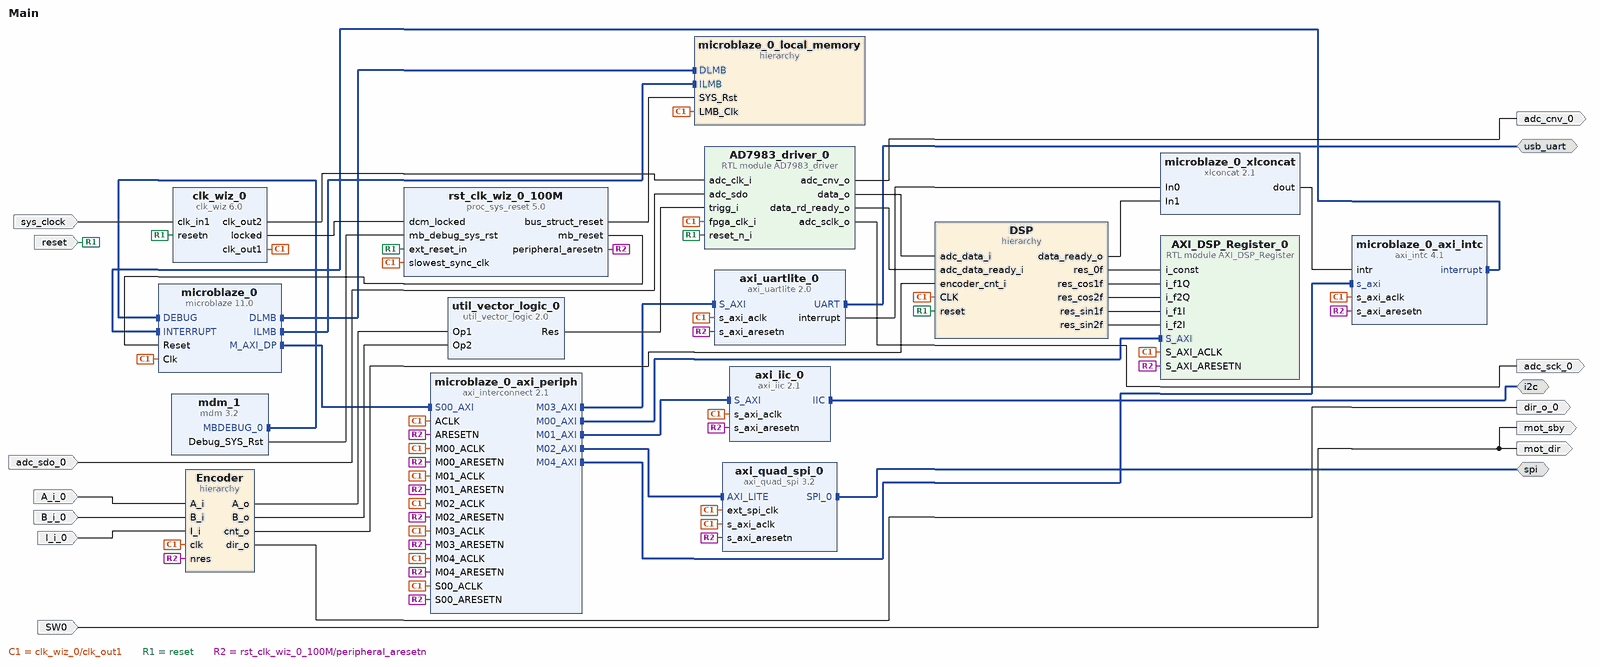
[diagram p0: block diagram of the top level]
# Vivado block design Main, xc7s25csga324-1, Vivado 2022.1
create_bd_design Main

create_bd_intf_port -mode Master -vlnv xilinx.com:interface:uart_rtl:1.0 usb_uart
create_bd_intf_port -mode Master -vlnv xilinx.com:interface:spi_rtl:1.0 spi
create_bd_intf_port -mode Master -vlnv xilinx.com:interface:iic_rtl:1.0 i2c
create_bd_port -dir I -type clk sys_clock
set_property -dict {CONFIG.FREQ_HZ 12000000 CONFIG.PHASE 0.0} [get_bd_ports sys_clock]
create_bd_port -dir I -type rst reset
set_property -dict {CONFIG.POLARITY ACTIVE_LOW} [get_bd_ports reset]
create_bd_port -dir I adc_sdo_0
create_bd_port -dir O adc_sck_0
create_bd_port -dir O adc_cnv_0
create_bd_port -dir I A_i_0
create_bd_port -dir I B_i_0
create_bd_port -dir I SW0
create_bd_port -dir O mot_dir
create_bd_port -dir O mot_sby
create_bd_port -dir I I_i_0
create_bd_port -dir O dir_o_0

create_bd_cell -type ip -vlnv xilinx.com:ip:microblaze:11.0 microblaze_0
set_property -dict [list \
  CONFIG.C_DEBUG_ENABLED 1 \
  CONFIG.C_D_AXI 1 \
  CONFIG.C_D_LMB 1 \
  CONFIG.C_I_LMB 1 \
  CONFIG.G_USE_EXCEPTIONS 1 \
] [get_bd_cells microblaze_0]
create_bd_cell -type ip -vlnv xilinx.com:ip:clk_wiz:6.0 clk_wiz_0
set_property -dict [list \
  CONFIG.CLKOUT1_JITTER 479.872 \
  CONFIG.CLKOUT1_PHASE_ERROR 668.310 \
  CONFIG.CLKOUT2_JITTER 560.330 \
  CONFIG.CLKOUT2_PHASE_ERROR 668.310 \
  CONFIG.CLKOUT2_REQUESTED_OUT_FREQ 30.000 \
  CONFIG.CLKOUT2_USED true \
  CONFIG.CLK_IN1_BOARD_INTERFACE sys_clock \
  CONFIG.MMCM_CLKFBOUT_MULT_F 62.500 \
  CONFIG.MMCM_CLKOUT0_DIVIDE_F 7.500 \
  CONFIG.MMCM_CLKOUT1_DIVIDE 25 \
  CONFIG.NUM_OUT_CLKS 2 \
  CONFIG.RESET_BOARD_INTERFACE reset \
  CONFIG.RESET_PORT resetn \
  CONFIG.RESET_TYPE ACTIVE_LOW \
  CONFIG.USE_BOARD_FLOW true \
] [get_bd_cells clk_wiz_0]
create_bd_cell -type hier microblaze_0_local_memory
create_bd_cell -type ip -vlnv xilinx.com:ip:axi_intc:4.1 microblaze_0_axi_intc
set_property -dict [list \
  CONFIG.C_EN_CASCADE_MODE 0 \
  CONFIG.C_HAS_FAST 0 \
  CONFIG.C_HAS_ILR 0 \
  CONFIG.C_IRQ_CONNECTION 0 \
  CONFIG.C_IRQ_IS_LEVEL 1 \
  CONFIG.C_NUM_SW_INTR 0 \
] [get_bd_cells microblaze_0_axi_intc]
create_bd_cell -type ip -vlnv xilinx.com:ip:xlconcat:2.1 microblaze_0_xlconcat
set_property -dict {CONFIG.NUM_PORTS 2} [get_bd_cells microblaze_0_xlconcat]
create_bd_cell -type ip -vlnv xilinx.com:ip:mdm:3.2 mdm_1
create_bd_cell -type ip -vlnv xilinx.com:ip:proc_sys_reset:5.0 rst_clk_wiz_0_100M
set_property -dict {CONFIG.RESET_BOARD_INTERFACE reset CONFIG.USE_BOARD_FLOW true} [get_bd_cells rst_clk_wiz_0_100M]
create_bd_cell -type ip -vlnv xilinx.com:ip:axi_uartlite:2.0 axi_uartlite_0
set_property -dict [list \
  CONFIG.C_BAUDRATE 230400 \
  CONFIG.UARTLITE_BOARD_INTERFACE usb_uart \
  CONFIG.USE_BOARD_FLOW true \
] [get_bd_cells axi_uartlite_0]
create_bd_cell -type ip -vlnv xilinx.com:ip:axi_quad_spi:3.2 axi_quad_spi_0
set_property -dict [list \
  CONFIG.C_NUM_TRANSFER_BITS 16 \
  CONFIG.C_SCK_RATIO 8 \
  CONFIG.Master_mode 0 \
  CONFIG.QSPI_BOARD_INTERFACE spi \
  CONFIG.USE_BOARD_FLOW true \
] [get_bd_cells axi_quad_spi_0]
create_bd_cell -type ip -vlnv xilinx.com:ip:axi_iic:2.1 axi_iic_0
set_property -dict {CONFIG.IIC_BOARD_INTERFACE i2c CONFIG.USE_BOARD_FLOW true} [get_bd_cells axi_iic_0]
create_bd_cell -type hier DSP
create_bd_cell -type ip -vlnv xilinx.com:ip:util_vector_logic:2.0 util_vector_logic_0
set_property -dict {CONFIG.C_OPERATION xor CONFIG.C_SIZE 1} [get_bd_cells util_vector_logic_0]
create_bd_cell -type module -reference AXI_DSP_Register AXI_DSP_Register_0
create_bd_cell -type hier Encoder
create_bd_cell -type ip -vlnv xilinx.com:ip:axi_interconnect:2.1 microblaze_0_axi_periph
set_property -dict {CONFIG.NUM_MI 5} [get_bd_cells microblaze_0_axi_periph]
create_bd_cell -type module -reference AD7983_driver AD7983_driver_0

# ---- hierarchy /microblaze_0_local_memory ----
current_bd_instance /microblaze_0_local_memory
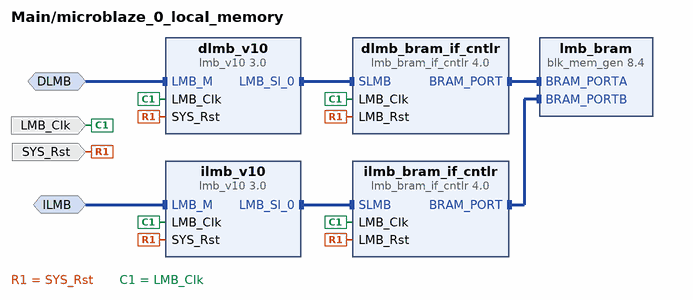
[diagram p1: block diagram inside /microblaze_0_local_memory]
create_bd_intf_pin -mode MirroredMaster -vlnv xilinx.com:interface:lmb_rtl:1.0 DLMB
create_bd_intf_pin -mode MirroredMaster -vlnv xilinx.com:interface:lmb_rtl:1.0 ILMB
create_bd_pin -dir I -type clk LMB_Clk
create_bd_pin -dir I -type rst SYS_Rst

create_bd_cell -type ip -vlnv xilinx.com:ip:lmb_v10:3.0 dlmb_v10
create_bd_cell -type ip -vlnv xilinx.com:ip:lmb_v10:3.0 ilmb_v10
create_bd_cell -type ip -vlnv xilinx.com:ip:lmb_bram_if_cntlr:4.0 dlmb_bram_if_cntlr
set_property -dict {CONFIG.C_ECC 0} [get_bd_cells dlmb_bram_if_cntlr]
create_bd_cell -type ip -vlnv xilinx.com:ip:lmb_bram_if_cntlr:4.0 ilmb_bram_if_cntlr
set_property -dict {CONFIG.C_ECC 0} [get_bd_cells ilmb_bram_if_cntlr]
create_bd_cell -type ip -vlnv xilinx.com:ip:blk_mem_gen:8.4 lmb_bram
set_property -dict {CONFIG.Memory_Type True_Dual_Port_RAM CONFIG.use_bram_block BRAM_Controller} [get_bd_cells lmb_bram]

# ---- hierarchy /DSP ----
current_bd_instance /DSP
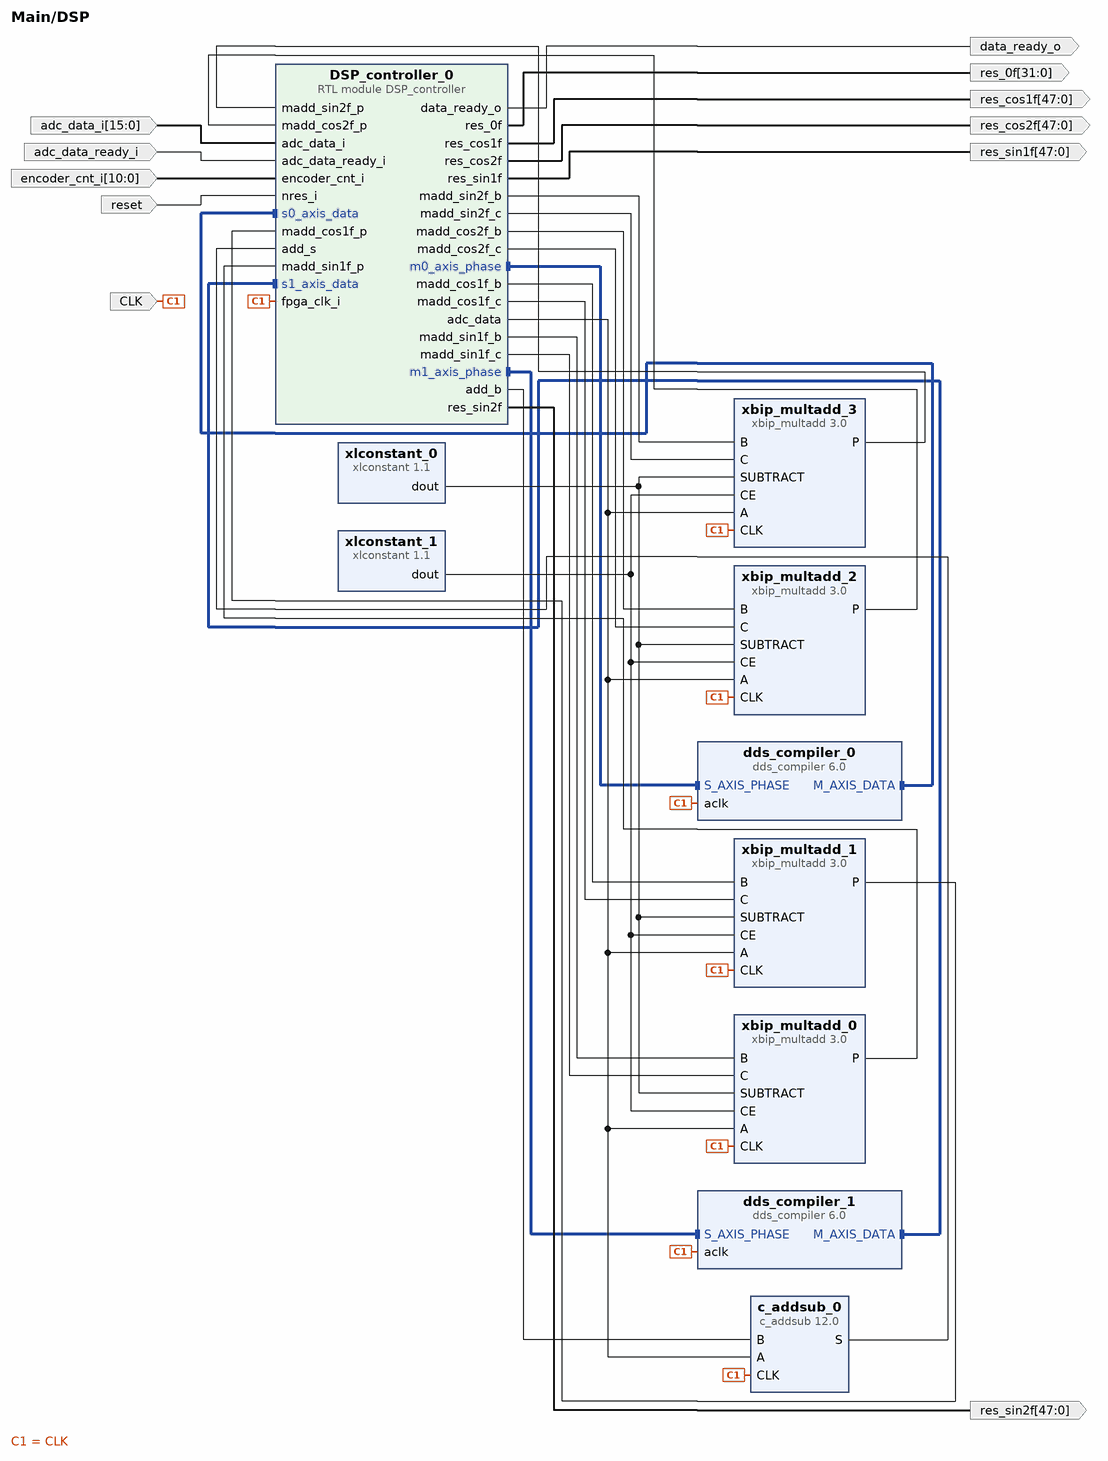
[diagram p2: block diagram inside /DSP]
create_bd_pin -dir I reset
create_bd_pin -dir I adc_data_ready_i
create_bd_pin -dir I -from 15 -to 0 adc_data_i
create_bd_pin -dir I -from 10 -to 0 encoder_cnt_i
create_bd_pin -dir I -type clk CLK
create_bd_pin -dir O -from 31 -to 0 res_0f
create_bd_pin -dir O -from 47 -to 0 res_sin1f
create_bd_pin -dir O -from 47 -to 0 res_cos1f
create_bd_pin -dir O -from 47 -to 0 res_sin2f
create_bd_pin -dir O data_ready_o
create_bd_pin -dir O -from 47 -to 0 res_cos2f

create_bd_cell -type ip -vlnv xilinx.com:ip:xbip_multadd:3.0 xbip_multadd_0
set_property -dict [list \
  CONFIG.c_a_type 1 \
  CONFIG.c_a_width 16 \
  CONFIG.c_b_type 0 \
  CONFIG.c_b_width 16 \
  CONFIG.c_out_high 47 \
  CONFIG.c_out_low 0 \
] [get_bd_cells xbip_multadd_0]
create_bd_cell -type ip -vlnv xilinx.com:ip:c_addsub:12.0 c_addsub_0
set_property -dict [list \
  CONFIG.A_Type Unsigned \
  CONFIG.A_Width 16 \
  CONFIG.B_Constant false \
  CONFIG.B_Type Signed \
  CONFIG.B_Value 00000000000000000000000000000000 \
  CONFIG.B_Width 32 \
  CONFIG.CE false \
  CONFIG.Implementation DSP48 \
  CONFIG.Latency 1 \
  CONFIG.Out_Width 32 \
] [get_bd_cells c_addsub_0]
create_bd_cell -type ip -vlnv xilinx.com:ip:xbip_multadd:3.0 xbip_multadd_1
set_property -dict [list \
  CONFIG.c_a_type 1 \
  CONFIG.c_a_width 16 \
  CONFIG.c_b_type 0 \
  CONFIG.c_b_width 16 \
  CONFIG.c_out_high 47 \
  CONFIG.c_out_low 0 \
] [get_bd_cells xbip_multadd_1]
create_bd_cell -type ip -vlnv xilinx.com:ip:xbip_multadd:3.0 xbip_multadd_2
set_property -dict [list \
  CONFIG.c_a_type 1 \
  CONFIG.c_a_width 16 \
  CONFIG.c_b_type 0 \
  CONFIG.c_b_width 16 \
  CONFIG.c_out_high 47 \
  CONFIG.c_out_low 0 \
] [get_bd_cells xbip_multadd_2]
create_bd_cell -type ip -vlnv xilinx.com:ip:xbip_multadd:3.0 xbip_multadd_3
set_property -dict [list \
  CONFIG.c_a_type 1 \
  CONFIG.c_a_width 16 \
  CONFIG.c_b_type 0 \
  CONFIG.c_b_width 16 \
  CONFIG.c_out_high 47 \
  CONFIG.c_out_low 0 \
] [get_bd_cells xbip_multadd_3]
create_bd_cell -type ip -vlnv xilinx.com:ip:xlconstant:1.1 xlconstant_0
set_property -dict {CONFIG.CONST_VAL 0} [get_bd_cells xlconstant_0]
create_bd_cell -type ip -vlnv xilinx.com:ip:xlconstant:1.1 xlconstant_1
set_property -dict {CONFIG.CONST_VAL 1} [get_bd_cells xlconstant_1]
create_bd_cell -type ip -vlnv xilinx.com:ip:dds_compiler:6.0 dds_compiler_0
set_property -dict [list \
  CONFIG.DATA_Has_TLAST Not_Required \
  CONFIG.DSP48_Use Minimal \
  CONFIG.Has_Phase_Out false \
  CONFIG.Has_TREADY false \
  CONFIG.Latency 2 \
  CONFIG.Latency_Configuration Auto \
  CONFIG.M_DATA_Has_TUSER Not_Required \
  CONFIG.M_PHASE_Has_TUSER Not_Required \
  CONFIG.Negative_Cosine false \
  CONFIG.Noise_Shaping None \
  CONFIG.Output_Frequency1 0 \
  CONFIG.Output_Selection Sine_and_Cosine \
  CONFIG.Output_Width 16 \
  CONFIG.PINC1 0 \
  CONFIG.Parameter_Entry Hardware_Parameters \
  CONFIG.PartsPresent SIN_COS_LUT_only \
  CONFIG.Phase_Width 10 \
  CONFIG.Phase_offset None \
  CONFIG.S_PHASE_Has_TUSER Not_Required \
] [get_bd_cells dds_compiler_0]
create_bd_cell -type ip -vlnv xilinx.com:ip:dds_compiler:6.0 dds_compiler_1
set_property -dict [list \
  CONFIG.DATA_Has_TLAST Not_Required \
  CONFIG.DSP48_Use Minimal \
  CONFIG.Has_Phase_Out false \
  CONFIG.Has_TREADY false \
  CONFIG.Latency 2 \
  CONFIG.Latency_Configuration Auto \
  CONFIG.M_DATA_Has_TUSER Not_Required \
  CONFIG.M_PHASE_Has_TUSER Not_Required \
  CONFIG.Negative_Cosine false \
  CONFIG.Noise_Shaping None \
  CONFIG.Output_Frequency1 0 \
  CONFIG.Output_Selection Sine_and_Cosine \
  CONFIG.Output_Width 16 \
  CONFIG.PINC1 0 \
  CONFIG.Parameter_Entry Hardware_Parameters \
  CONFIG.PartsPresent SIN_COS_LUT_only \
  CONFIG.Phase_Width 9 \
  CONFIG.Phase_offset None \
  CONFIG.S_PHASE_Has_TUSER Not_Required \
] [get_bd_cells dds_compiler_1]
create_bd_cell -type module -reference DSP_controller DSP_controller_0

# ---- hierarchy /Encoder ----
current_bd_instance /Encoder
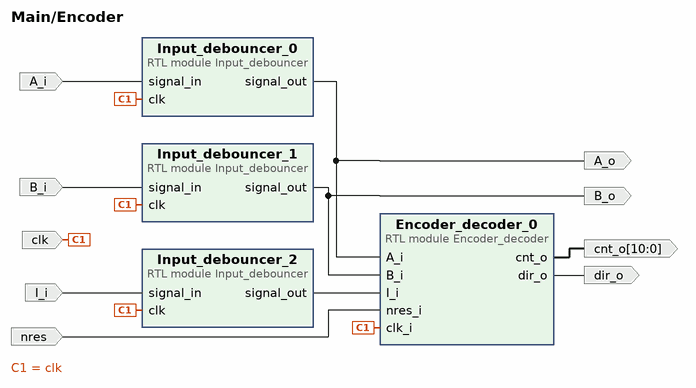
[diagram p3: block diagram inside /Encoder]
create_bd_pin -dir I -type clk clk
create_bd_pin -dir I I_i
create_bd_pin -dir O dir_o
create_bd_pin -dir I nres
create_bd_pin -dir O -from 10 -to 0 cnt_o
create_bd_pin -dir O A_o
create_bd_pin -dir I A_i
create_bd_pin -dir O B_o
create_bd_pin -dir I B_i

create_bd_cell -type module -reference Encoder_decoder Encoder_decoder_0
create_bd_cell -type module -reference Input_debouncer Input_debouncer_0
create_bd_cell -type module -reference Input_debouncer Input_debouncer_1
create_bd_cell -type module -reference Input_debouncer Input_debouncer_2

# ---- connections ----

current_bd_instance /microblaze_0_local_memory
connect_bd_intf_net -intf_net microblaze_0_dlmb [get_bd_intf_pins DLMB] [get_bd_intf_pins dlmb_v10/LMB_M]
connect_bd_intf_net -intf_net microblaze_0_dlmb_bus [get_bd_intf_pins dlmb_v10/LMB_Sl_0] [get_bd_intf_pins dlmb_bram_if_cntlr/SLMB]
connect_bd_intf_net -intf_net microblaze_0_dlmb_cntlr [get_bd_intf_pins dlmb_bram_if_cntlr/BRAM_PORT] [get_bd_intf_pins lmb_bram/BRAM_PORTA]
connect_bd_intf_net -intf_net microblaze_0_ilmb [get_bd_intf_pins ILMB] [get_bd_intf_pins ilmb_v10/LMB_M]
connect_bd_intf_net -intf_net microblaze_0_ilmb_bus [get_bd_intf_pins ilmb_v10/LMB_Sl_0] [get_bd_intf_pins ilmb_bram_if_cntlr/SLMB]
connect_bd_intf_net -intf_net microblaze_0_ilmb_cntlr [get_bd_intf_pins ilmb_bram_if_cntlr/BRAM_PORT] [get_bd_intf_pins lmb_bram/BRAM_PORTB]
connect_bd_net [get_bd_pins SYS_Rst] \
  [get_bd_pins dlmb_v10/SYS_Rst] [get_bd_pins dlmb_bram_if_cntlr/LMB_Rst] [get_bd_pins ilmb_v10/SYS_Rst] \
  [get_bd_pins ilmb_bram_if_cntlr/LMB_Rst]
connect_bd_net -net microblaze_0_Clk [get_bd_pins LMB_Clk] \
  [get_bd_pins dlmb_v10/LMB_Clk] [get_bd_pins dlmb_bram_if_cntlr/LMB_Clk] [get_bd_pins ilmb_v10/LMB_Clk] \
  [get_bd_pins ilmb_bram_if_cntlr/LMB_Clk]
set_property HDL_ATTRIBUTE.BMM_INFO_ADDRESS_SPACE {byte  0x00000000 32 > Main microblaze_0_local_memory/lmb_bram} [get_bd_cells dlmb_bram_if_cntlr]
set_property HDL_ATTRIBUTE.KEEP_HIERARCHY yes [get_bd_cells dlmb_bram_if_cntlr]

current_bd_instance /DSP
connect_bd_intf_net [get_bd_intf_pins dds_compiler_0/S_AXIS_PHASE] [get_bd_intf_pins DSP_controller_0/m0_axis_phase]
connect_bd_intf_net [get_bd_intf_pins dds_compiler_1/S_AXIS_PHASE] [get_bd_intf_pins DSP_controller_0/m1_axis_phase]
connect_bd_intf_net [get_bd_intf_pins dds_compiler_0/M_AXIS_DATA] [get_bd_intf_pins DSP_controller_0/s0_axis_data]
connect_bd_intf_net [get_bd_intf_pins dds_compiler_1/M_AXIS_DATA] [get_bd_intf_pins DSP_controller_0/s1_axis_data]
connect_bd_net [get_bd_pins CLK] \
  [get_bd_pins c_addsub_0/CLK] [get_bd_pins xbip_multadd_0/CLK] [get_bd_pins xbip_multadd_1/CLK] \
  [get_bd_pins xbip_multadd_3/CLK] [get_bd_pins xbip_multadd_2/CLK] [get_bd_pins dds_compiler_0/aclk] \
  [get_bd_pins dds_compiler_1/aclk] [get_bd_pins DSP_controller_0/fpga_clk_i]
connect_bd_net [get_bd_pins DSP_controller_0/adc_data] \
  [get_bd_pins xbip_multadd_2/A] [get_bd_pins xbip_multadd_3/A] [get_bd_pins xbip_multadd_1/A] [get_bd_pins xbip_multadd_0/A] \
  [get_bd_pins c_addsub_0/A]
connect_bd_net [get_bd_pins DSP_controller_0/add_b] [get_bd_pins c_addsub_0/B]
connect_bd_net [get_bd_pins DSP_controller_0/data_ready_o] [get_bd_pins data_ready_o]
connect_bd_net [get_bd_pins DSP_controller_0/madd_cos1f_b] [get_bd_pins xbip_multadd_1/B]
connect_bd_net [get_bd_pins DSP_controller_0/madd_cos1f_c] [get_bd_pins xbip_multadd_1/C]
connect_bd_net [get_bd_pins DSP_controller_0/madd_cos2f_b] [get_bd_pins xbip_multadd_2/B]
connect_bd_net [get_bd_pins DSP_controller_0/madd_cos2f_c] [get_bd_pins xbip_multadd_2/C]
connect_bd_net [get_bd_pins DSP_controller_0/madd_sin1f_b] [get_bd_pins xbip_multadd_0/B]
connect_bd_net [get_bd_pins DSP_controller_0/madd_sin1f_c] [get_bd_pins xbip_multadd_0/C]
connect_bd_net [get_bd_pins DSP_controller_0/madd_sin2f_b] [get_bd_pins xbip_multadd_3/B]
connect_bd_net [get_bd_pins DSP_controller_0/madd_sin2f_c] [get_bd_pins xbip_multadd_3/C]
connect_bd_net [get_bd_pins DSP_controller_0/res_0f] [get_bd_pins res_0f]
connect_bd_net [get_bd_pins DSP_controller_0/res_cos1f] [get_bd_pins res_cos1f]
connect_bd_net [get_bd_pins DSP_controller_0/res_cos2f] [get_bd_pins res_cos2f]
connect_bd_net [get_bd_pins DSP_controller_0/res_sin1f] [get_bd_pins res_sin1f]
connect_bd_net [get_bd_pins DSP_controller_0/res_sin2f] [get_bd_pins res_sin2f]
connect_bd_net [get_bd_pins adc_data_i] [get_bd_pins DSP_controller_0/adc_data_i]
connect_bd_net [get_bd_pins adc_data_ready_i] [get_bd_pins DSP_controller_0/adc_data_ready_i]
connect_bd_net [get_bd_pins c_addsub_0/S] [get_bd_pins DSP_controller_0/add_s]
connect_bd_net [get_bd_pins encoder_cnt_i] [get_bd_pins DSP_controller_0/encoder_cnt_i]
connect_bd_net [get_bd_pins reset] [get_bd_pins DSP_controller_0/nres_i]
connect_bd_net [get_bd_pins xbip_multadd_0/P] [get_bd_pins DSP_controller_0/madd_sin1f_p]
connect_bd_net [get_bd_pins xbip_multadd_1/P] [get_bd_pins DSP_controller_0/madd_cos1f_p]
connect_bd_net [get_bd_pins xbip_multadd_2/P] [get_bd_pins DSP_controller_0/madd_cos2f_p]
connect_bd_net [get_bd_pins xbip_multadd_3/P] [get_bd_pins DSP_controller_0/madd_sin2f_p]
connect_bd_net [get_bd_pins xlconstant_0/dout] \
  [get_bd_pins xbip_multadd_2/SUBTRACT] [get_bd_pins xbip_multadd_3/SUBTRACT] [get_bd_pins xbip_multadd_1/SUBTRACT] \
  [get_bd_pins xbip_multadd_0/SUBTRACT]
connect_bd_net [get_bd_pins xlconstant_1/dout] \
  [get_bd_pins xbip_multadd_2/CE] [get_bd_pins xbip_multadd_3/CE] [get_bd_pins xbip_multadd_1/CE] \
  [get_bd_pins xbip_multadd_0/CE]

current_bd_instance /Encoder
connect_bd_net -net A_i_0_1 [get_bd_pins A_i] [get_bd_pins Input_debouncer_0/signal_in]
connect_bd_net -net B_i_0_1 [get_bd_pins B_i] [get_bd_pins Input_debouncer_1/signal_in]
connect_bd_net [get_bd_pins Encoder_decoder_0/cnt_o] [get_bd_pins cnt_o]
connect_bd_net [get_bd_pins Encoder_decoder_0/dir_o] [get_bd_pins dir_o]
connect_bd_net -net I_i_0_1 [get_bd_pins I_i] [get_bd_pins Input_debouncer_2/signal_in]
connect_bd_net -net Input_debouncer_0_out [get_bd_pins Input_debouncer_0/signal_out] [get_bd_pins A_o] [get_bd_pins Encoder_decoder_0/A_i]
connect_bd_net -net Input_debouncer_1_out [get_bd_pins Input_debouncer_1/signal_out] [get_bd_pins B_o] [get_bd_pins Encoder_decoder_0/B_i]
connect_bd_net -net Input_debouncer_2_out [get_bd_pins Input_debouncer_2/signal_out] [get_bd_pins Encoder_decoder_0/I_i]
connect_bd_net [get_bd_pins clk] \
  [get_bd_pins Encoder_decoder_0/clk_i] [get_bd_pins Input_debouncer_0/clk] [get_bd_pins Input_debouncer_1/clk] \
  [get_bd_pins Input_debouncer_2/clk]
connect_bd_net -net nres_i_1 [get_bd_pins nres] [get_bd_pins Encoder_decoder_0/nres_i]

current_bd_instance /
connect_bd_intf_net [get_bd_intf_ports i2c] [get_bd_intf_pins axi_iic_0/IIC]
connect_bd_intf_net [get_bd_intf_ports spi] [get_bd_intf_pins axi_quad_spi_0/SPI_0]
connect_bd_intf_net [get_bd_intf_ports usb_uart] [get_bd_intf_pins axi_uartlite_0/UART]
connect_bd_intf_net [get_bd_intf_pins microblaze_0/M_AXI_DP] [get_bd_intf_pins microblaze_0_axi_periph/S00_AXI]
connect_bd_intf_net [get_bd_intf_pins microblaze_0_axi_intc/interrupt] [get_bd_intf_pins microblaze_0/INTERRUPT]
connect_bd_intf_net [get_bd_intf_pins microblaze_0_axi_periph/M00_AXI] [get_bd_intf_pins AXI_DSP_Register_0/S_AXI]
connect_bd_intf_net [get_bd_intf_pins microblaze_0_axi_periph/M01_AXI] [get_bd_intf_pins axi_iic_0/S_AXI]
connect_bd_intf_net [get_bd_intf_pins microblaze_0_axi_periph/M02_AXI] [get_bd_intf_pins axi_quad_spi_0/AXI_LITE]
connect_bd_intf_net [get_bd_intf_pins microblaze_0_axi_periph/M03_AXI] [get_bd_intf_pins axi_uartlite_0/S_AXI]
connect_bd_intf_net [get_bd_intf_pins microblaze_0_axi_periph/M04_AXI] [get_bd_intf_pins microblaze_0_axi_intc/s_axi]
connect_bd_intf_net [get_bd_intf_pins mdm_1/MBDEBUG_0] [get_bd_intf_pins microblaze_0/DEBUG]
connect_bd_intf_net [get_bd_intf_pins microblaze_0/DLMB] [get_bd_intf_pins microblaze_0_local_memory/DLMB]
connect_bd_intf_net [get_bd_intf_pins microblaze_0/ILMB] [get_bd_intf_pins microblaze_0_local_memory/ILMB]
connect_bd_net -net AD7983_driver_0_adc_cnv [get_bd_pins AD7983_driver_0/adc_cnv_o] [get_bd_ports adc_cnv_0]
connect_bd_net -net AD7983_driver_0_adc_sck [get_bd_pins AD7983_driver_0/adc_sclk_o] [get_bd_ports adc_sck_0]
connect_bd_net [get_bd_pins AD7983_driver_0/data_o] [get_bd_pins DSP/adc_data_i]
connect_bd_net [get_bd_pins AD7983_driver_0/data_rd_ready_o] [get_bd_pins DSP/adc_data_ready_i]
connect_bd_net -net A_i_0_1 [get_bd_ports A_i_0] [get_bd_pins Encoder/A_i]
connect_bd_net -net B_i_0_1 [get_bd_ports B_i_0] [get_bd_pins Encoder/B_i]
connect_bd_net [get_bd_pins DSP/data_ready_o] [get_bd_pins microblaze_0_xlconcat/In1]
connect_bd_net [get_bd_pins DSP/res_0f] [get_bd_pins AXI_DSP_Register_0/i_const]
connect_bd_net [get_bd_pins DSP/res_cos1f] [get_bd_pins AXI_DSP_Register_0/i_f1Q]
connect_bd_net [get_bd_pins DSP/res_cos2f] [get_bd_pins AXI_DSP_Register_0/i_f2Q]
connect_bd_net [get_bd_pins DSP/res_sin1f] [get_bd_pins AXI_DSP_Register_0/i_f1I]
connect_bd_net [get_bd_pins DSP/res_sin2f] [get_bd_pins AXI_DSP_Register_0/i_f2I]
connect_bd_net [get_bd_pins Encoder/dir_o] [get_bd_ports dir_o_0]
connect_bd_net -net I_i_0_1 [get_bd_ports I_i_0] [get_bd_pins Encoder/I_i]
connect_bd_net -net Input_debouncer_0_out [get_bd_pins Encoder/A_o] [get_bd_pins util_vector_logic_0/Op1]
connect_bd_net -net Input_debouncer_1_out [get_bd_pins Encoder/B_o] [get_bd_pins util_vector_logic_0/Op2]
connect_bd_net -net SW0_1 [get_bd_ports SW0] [get_bd_ports mot_dir] [get_bd_ports mot_sby]
connect_bd_net -net adc_sdo_0_1 [get_bd_ports adc_sdo_0] [get_bd_pins AD7983_driver_0/adc_sdo]
connect_bd_net [get_bd_pins axi_uartlite_0/interrupt] [get_bd_pins microblaze_0_xlconcat/In0]
connect_bd_net [get_bd_pins clk_wiz_0/clk_out2] [get_bd_pins AD7983_driver_0/adc_clk_i]
connect_bd_net [get_bd_pins clk_wiz_0/locked] [get_bd_pins rst_clk_wiz_0_100M/dcm_locked]
connect_bd_net -net encoder_cnt_i_1 [get_bd_pins Encoder/cnt_o] [get_bd_pins DSP/encoder_cnt_i]
connect_bd_net [get_bd_pins mdm_1/Debug_SYS_Rst] [get_bd_pins rst_clk_wiz_0_100M/mb_debug_sys_rst]
connect_bd_net -net microblaze_0_Clk [get_bd_pins clk_wiz_0/clk_out1] \
  [get_bd_pins microblaze_0/Clk] [get_bd_pins microblaze_0_axi_intc/s_axi_aclk] \
  [get_bd_pins microblaze_0_local_memory/LMB_Clk] [get_bd_pins rst_clk_wiz_0_100M/slowest_sync_clk] \
  [get_bd_pins axi_uartlite_0/s_axi_aclk] [get_bd_pins axi_quad_spi_0/s_axi_aclk] [get_bd_pins axi_quad_spi_0/ext_spi_clk] \
  [get_bd_pins axi_iic_0/s_axi_aclk] [get_bd_pins DSP/CLK] [get_bd_pins AXI_DSP_Register_0/S_AXI_ACLK] \
  [get_bd_pins Encoder/clk] [get_bd_pins microblaze_0_axi_periph/ACLK] [get_bd_pins microblaze_0_axi_periph/S00_ACLK] \
  [get_bd_pins microblaze_0_axi_periph/M00_ACLK] [get_bd_pins microblaze_0_axi_periph/M01_ACLK] \
  [get_bd_pins microblaze_0_axi_periph/M02_ACLK] [get_bd_pins microblaze_0_axi_periph/M03_ACLK] \
  [get_bd_pins microblaze_0_axi_periph/M04_ACLK] [get_bd_pins AD7983_driver_0/fpga_clk_i]
connect_bd_net -net microblaze_0_intr [get_bd_pins microblaze_0_xlconcat/dout] [get_bd_pins microblaze_0_axi_intc/intr]
connect_bd_net [get_bd_ports reset] \
  [get_bd_pins clk_wiz_0/resetn] [get_bd_pins rst_clk_wiz_0_100M/ext_reset_in] [get_bd_pins DSP/reset] \
  [get_bd_pins AD7983_driver_0/reset_n_i]
connect_bd_net [get_bd_pins rst_clk_wiz_0_100M/bus_struct_reset] [get_bd_pins microblaze_0_local_memory/SYS_Rst]
connect_bd_net [get_bd_pins rst_clk_wiz_0_100M/mb_reset] [get_bd_pins microblaze_0/Reset]
connect_bd_net [get_bd_pins rst_clk_wiz_0_100M/peripheral_aresetn] \
  [get_bd_pins microblaze_0_axi_intc/s_axi_aresetn] [get_bd_pins axi_uartlite_0/s_axi_aresetn] \
  [get_bd_pins axi_quad_spi_0/s_axi_aresetn] [get_bd_pins axi_iic_0/s_axi_aresetn] \
  [get_bd_pins AXI_DSP_Register_0/S_AXI_ARESETN] [get_bd_pins Encoder/nres] [get_bd_pins microblaze_0_axi_periph/S00_ARESETN] \
  [get_bd_pins microblaze_0_axi_periph/M00_ARESETN] [get_bd_pins microblaze_0_axi_periph/ARESETN] \
  [get_bd_pins microblaze_0_axi_periph/M01_ARESETN] [get_bd_pins microblaze_0_axi_periph/M02_ARESETN] \
  [get_bd_pins microblaze_0_axi_periph/M03_ARESETN] [get_bd_pins microblaze_0_axi_periph/M04_ARESETN]
connect_bd_net [get_bd_ports sys_clock] [get_bd_pins clk_wiz_0/clk_in1]
connect_bd_net [get_bd_pins util_vector_logic_0/Res] [get_bd_pins AD7983_driver_0/trigg_i]
set_property HDL_ATTRIBUTE.BMM_INFO_PROCESSOR {microblaze-le > Main microblaze_0_local_memory/dlmb_bram_if_cntlr} [get_bd_cells microblaze_0]
set_property HDL_ATTRIBUTE.KEEP_HIERARCHY yes [get_bd_cells microblaze_0]

# ---- address map ----
assign_bd_address -offset 0x00000000 -range 32K -target_address_space [get_bd_addr_spaces microblaze_0/Data] [get_bd_addr_segs microblaze_0_local_memory/dlmb_bram_if_cntlr/SLMB/Mem]
assign_bd_address -offset 0x00010000 -range 4K -target_address_space [get_bd_addr_spaces microblaze_0/Data] [get_bd_addr_segs AXI_DSP_Register_0/S_AXI/reg0]
assign_bd_address -offset 0x40600000 -range 64K -target_address_space [get_bd_addr_spaces microblaze_0/Data] [get_bd_addr_segs axi_uartlite_0/S_AXI/Reg]
assign_bd_address -offset 0x40800000 -range 64K -target_address_space [get_bd_addr_spaces microblaze_0/Data] [get_bd_addr_segs axi_iic_0/S_AXI/Reg]
assign_bd_address -offset 0x41200000 -range 64K -target_address_space [get_bd_addr_spaces microblaze_0/Data] [get_bd_addr_segs microblaze_0_axi_intc/S_AXI/Reg]
assign_bd_address -offset 0x44A00000 -range 64K -target_address_space [get_bd_addr_spaces microblaze_0/Data] [get_bd_addr_segs axi_quad_spi_0/AXI_LITE/Reg]
assign_bd_address -offset 0x00000000 -range 32K -target_address_space [get_bd_addr_spaces microblaze_0/Instruction] [get_bd_addr_segs microblaze_0_local_memory/ilmb_bram_if_cntlr/SLMB/Mem]

validate_bd_design
save_bd_design
